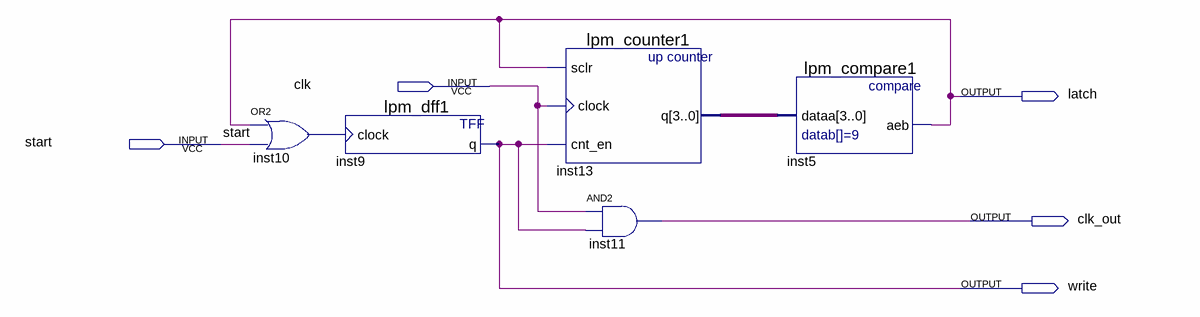
[diagram p0: schematic sheet]
// Quartus schematic buf_write.bdf as structural Verilog: 5 symbols, 5 pins
module buf_write (
  input  clk,
  input  start,
  output latch,
  output clk_out,
  output write
);

  wire inst10_out;
  wire [3:0] inst13_q;

  or inst10 (inst10_out, latch, start);
  lpm_dff1 inst9 (.clock(inst10_out), .q(write));
  lpm_counter1 inst13 (.sclr(latch), .clock(clk), .cnt_en(write), .q(inst13_q));
  and inst11 (clk_out, clk, write);
  lpm_compare1 inst5 (.dataa(inst13_q), .aeb(latch));
endmodule
